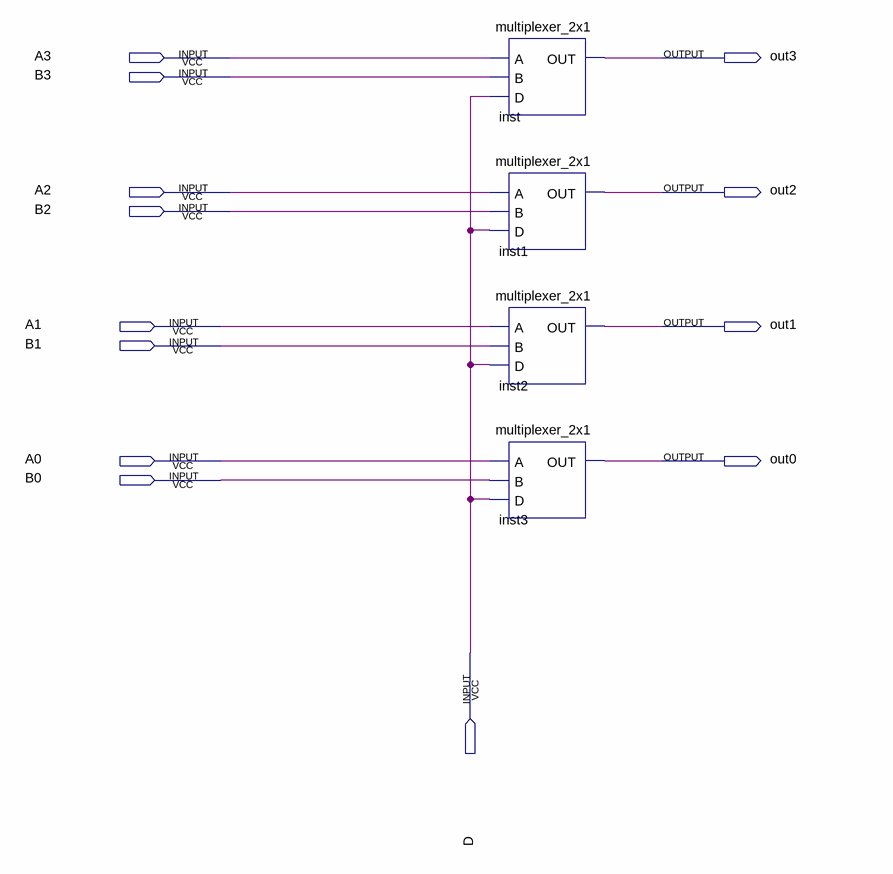
[diagram p0: schematic sheet]
// Quartus schematic multiplexer_2x1_4bits.bdf as structural Verilog: 4 symbols, 13 pins
module multiplexer_2x1_4bits (
  input  A3,
  input  B3,
  input  A2,
  input  B2,
  input  A1,
  input  B1,
  input  A0,
  input  B0,
  input  D,
  output out3,
  output out2,
  output out1,
  output out0
);

  multiplexer_2x1 inst (.A(A3), .B(B3), .D(D), .OUT(out3));
  multiplexer_2x1 inst1 (.A(A2), .B(B2), .D(D), .OUT(out2));
  multiplexer_2x1 inst2 (.A(A1), .B(B1), .D(D), .OUT(out1));
  multiplexer_2x1 inst3 (.A(A0), .B(B0), .D(D), .OUT(out0));
endmodule
